# EAGLE design untitled (EAGLE 9.6.2)
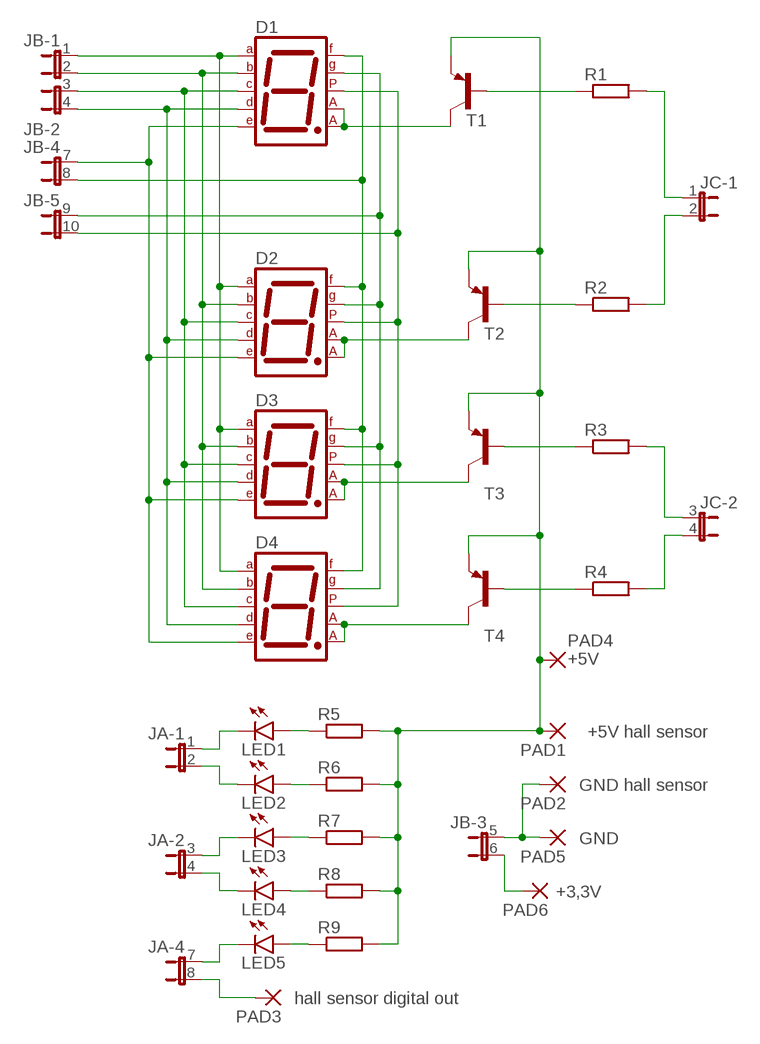
[diagram p0: schematic, sheet 1]

## Parts
D1  7SEG-CA  [7SEG-13]
D2  7SEG-CA  [7SEG-13]
D3  7SEG-CA  [7SEG-13]
D4  7SEG-CA  [7SEG-13]
JA  JP6QE  [JP6Q]
JB  JP6QE  [JP6Q]
JC  JP6QE  [JP6Q]
LED1  LED5MM  [LED5MM]
LED2  LED5MM  [LED5MM]
LED3  LED5MM  [LED5MM]
LED4  LED5MM  [LED5MM]
LED5  LED5MM  [LED5MM]
PAD1  +5V hall sensor  WIREPAD2,15/1,0  [2,15/1,0]
PAD2  GND hall sensor  WIREPAD2,15/1,0  [2,15/1,0]
PAD3  hall sensor digital out  WIREPAD2,15/1,0  [2,15/1,0]
PAD4  +5V  WIREPAD2,15/1,0  [2,15/1,0]
PAD5  GND  WIREPAD2,15/1,0  [2,15/1,0]
PAD6  +3,3V  WIREPAD2,15/1,0  [2,15/1,0]
R1  R-EU_0204/7  [0204/7]
R2  R-EU_0204/7  [0204/7]
R3  R-EU_0204/7  [0204/7]
R4  R-EU_0204/7  [0204/7]
R5  R-EU_0204/7  [0204/7]
R6  R-EU_0204/7  [0204/7]
R7  R-EU_0204/7  [0204/7]
R8  R-EU_0204/7  [0204/7]
R9  R-EU_0204/7  [0204/7]
T1  BC327-25-PNP-TO92-EBC  [TO92-EBC]
T2  BC327-25-PNP-TO92-EBC  [TO92-EBC]
T3  BC327-25-PNP-TO92-EBC  [TO92-EBC]
T4  BC327-25-PNP-TO92-EBC  [TO92-EBC]

## Nets
N$1: D1.7(A) D2.7(A) D3.7(A) D4.7(A) JB.1
N$2: D1.6(B) D2.6(B) D3.6(B) D4.6(B) JB.2
N$3: D1.2(D) D2.2(D) D3.2(D) D4.2(D) JB.4
N$4: D1.4(C) D2.4(C) D3.4(C) D4.4(C) JB.3
N$5: D1.1(E) D2.1(E) D3.1(E) D4.1(E) JB.7
N$6: D1.9(F) D2.9(F) D3.9(F) D4.9(F) JB.8
N$7: D1.10(G) D2.10(G) D3.10(G) D4.10(G) JB.9
N$8: D1.5(DP) D2.5(DP) D3.5(DP) D4.5(DP) JB.10
N$9: D1.3(CA1) D1.8(CA2) T1.C
N$10: D2.3(CA1) D2.8(CA2) T2.C
N$11: D3.3(CA1) D3.8(CA2) T3.C
N$12: D4.3(CA1) D4.8(CA2) T4.C
N$13: PAD1.1(P) PAD4.1(P) R5.2 R6.2 R7.2 R8.2 R9.2 T1.E T2.E T3.E T4.E
N$14: R1.1 T1.B
N$15: R2.1 T2.B
N$16: R3.1 T3.B
N$17: R4.1 T4.B
N$18: LED1.A R5.1
N$19: LED2.A R6.1
N$20: LED3.A R7.1
N$21: LED4.A R8.1
N$22: LED5.A R9.1
N$23: JC.1 R1.2
N$24: JC.2 R2.2
N$25: JC.3 R3.2
N$26: JC.4 R4.2
N$27: JA.1 LED1.K(C)
N$28: JA.2 LED2.K(C)
N$29: JA.3 LED3.K(C)
N$30: JA.4 LED4.K(C)
N$31: JA.7 LED5.K(C)
N$32: JA.8 PAD3.1(P)
N$33: JB.5 PAD2.1(P) PAD5.1(P)
N$34: JB.6 PAD6.1(P)
Unconnected: JA.5 JA.6 JA.9 JA.10 JA.11 JA.12 JB.11 JB.12 JC.5 JC.6 JC.7 JC.8 JC.9 JC.10 JC.11 JC.12

## Library data of the parts
D1-D4 = special:7SEG-CA: 7-segment DISPLAY single anode, 13 mm
JA JB JC = jumper:JP6QE: JUMPER
LED1-LED5 = led:LED: LED OSRAM: - CHIPLED LG R971, LG N971, LY N971, LG Q971, LY Q971, LO R971, LY R971 LH N974, LH R974 LS Q976, LO Q976, LY Q976 LO Q996 - Hyper CHIPLED LW Q18S LB Q993, LB Q99A, LB R99A - SideLED LS A670, LO A670, LY A670, LG A670, LP A670 LB A673, LV A673, LT A673, LW A673 LH A674 LY A675 LS A676, LA A676, LO A676, LY A676, LW A676 LS A679, LY A679, LG A679 - Hyper Micro SIDELED® LS Y876, LA Y876, LO Y876, LY Y876 LT Y87S - SmartLED LW L88C, LW L88S LB L89C, LB L89S, LG L890 LS L89K, LO L89K, LY L89K LS L896, LA L896, LO L896, LY L896 - TOPLED LS T670, LO T670, LY T670, LG T670, LP T670 LSG T670, LSP T670, LSY T670, LOP T670, LYG T670 LG T671, LOG T671, LSG T671 LB T673, LV T673, LT T673, LW T673 LH T674 LS T676, LA T676, LO T676, LY T676, LB T676, LH T676, LSB T676, LW T676 LB T67C, LV T67C, LT T67C, LS T67K, LO T67K, LY T67K, LW E67C LS E67B, LA E67B, LO E67B, LY E67B, LB E67C, LV E67C, LT E67C LW T67C LS T679, LY T679, LG T679 LS T770, LO T770, LY T770, LG T770, LP T770 LB T773, LV T773, LT T773, LW T773 LH T774 LS E675, LA E675, LY E675, LS T675 LS T776, LA T776, LO T776, LY T776, LB T776 LHGB T686 LT T68C, LB T68C - Hyper Mini TOPLED® LB M676 - Mini TOPLED Santana® LG M470 LS M47K, LO M47K, LY M47K Source: http://www.osram.convergy.de LUXEON: - LUMILED® LXK2-PW12-R00, LXK2-PW12-S00, LXK2-PW14-U00, LXK2-PW14-V00 LXK2-PM12-R00, LXK2-PM12-S00, LXK2-PM14-U00 LXK2-PE12-Q00, LXK2-PE12-R00, LXK2-PE12-S00, LXK2-PE14-T00, LXK2-PE14-U00 LXK2-PB12-K00, LXK2-PB12-L00, LXK2-PB12-M00, LXK2-PB14-N00, LXK2-PB14-P00, LXK2-PB14-Q00 LXK2-PR12-L00, LXK2-PR12-M00, LXK2-PR14-Q00, LXK2-PR14-R00 LXK2-PD12-Q00, LXK2-PD12-R00, LXK2-PD12-S00 LXK2-PH12-R00, LXK2-PH12-S00 LXK2-PL12-P00, LXK2-PL12-Q00, LXK2-PL12-R00 Source: www.luxeon.com KINGBRIGHT: KA-3528ASYC Source: www.kingbright.com
PAD1-PAD6 = wirepad:WIREPAD: Wire PAD connect wire on PCB
R1-R9 = rcl:R-EU_: RESISTOR, European symbol; SPICEPREFIX: R
T1-T4 = transistor:*-PNP-: PNP Transistror

## Board
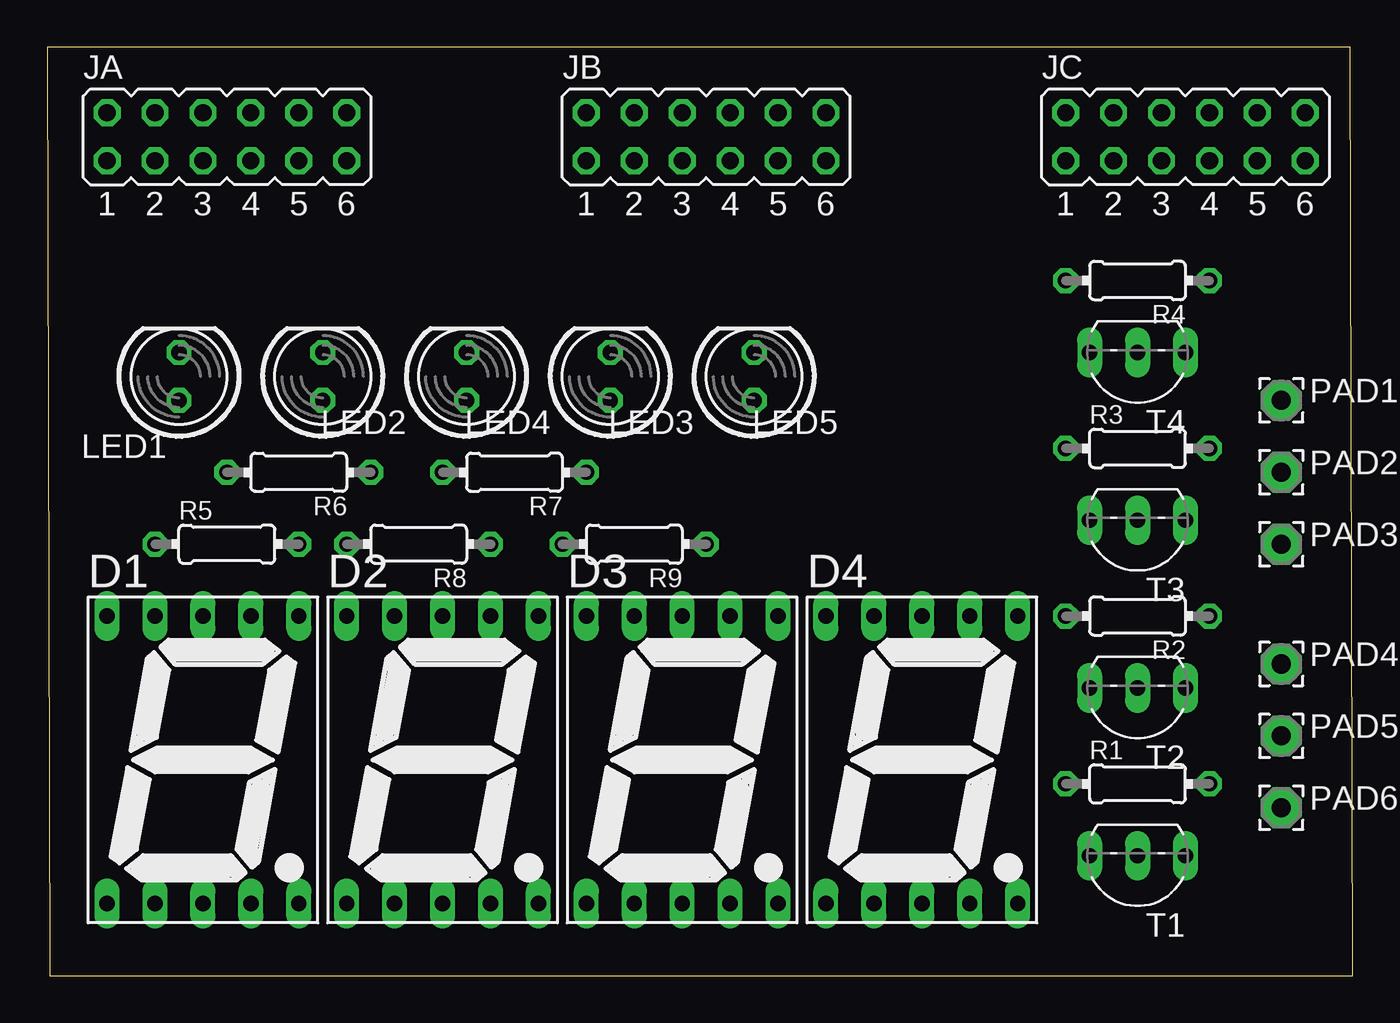
[diagram p1: board, top side]
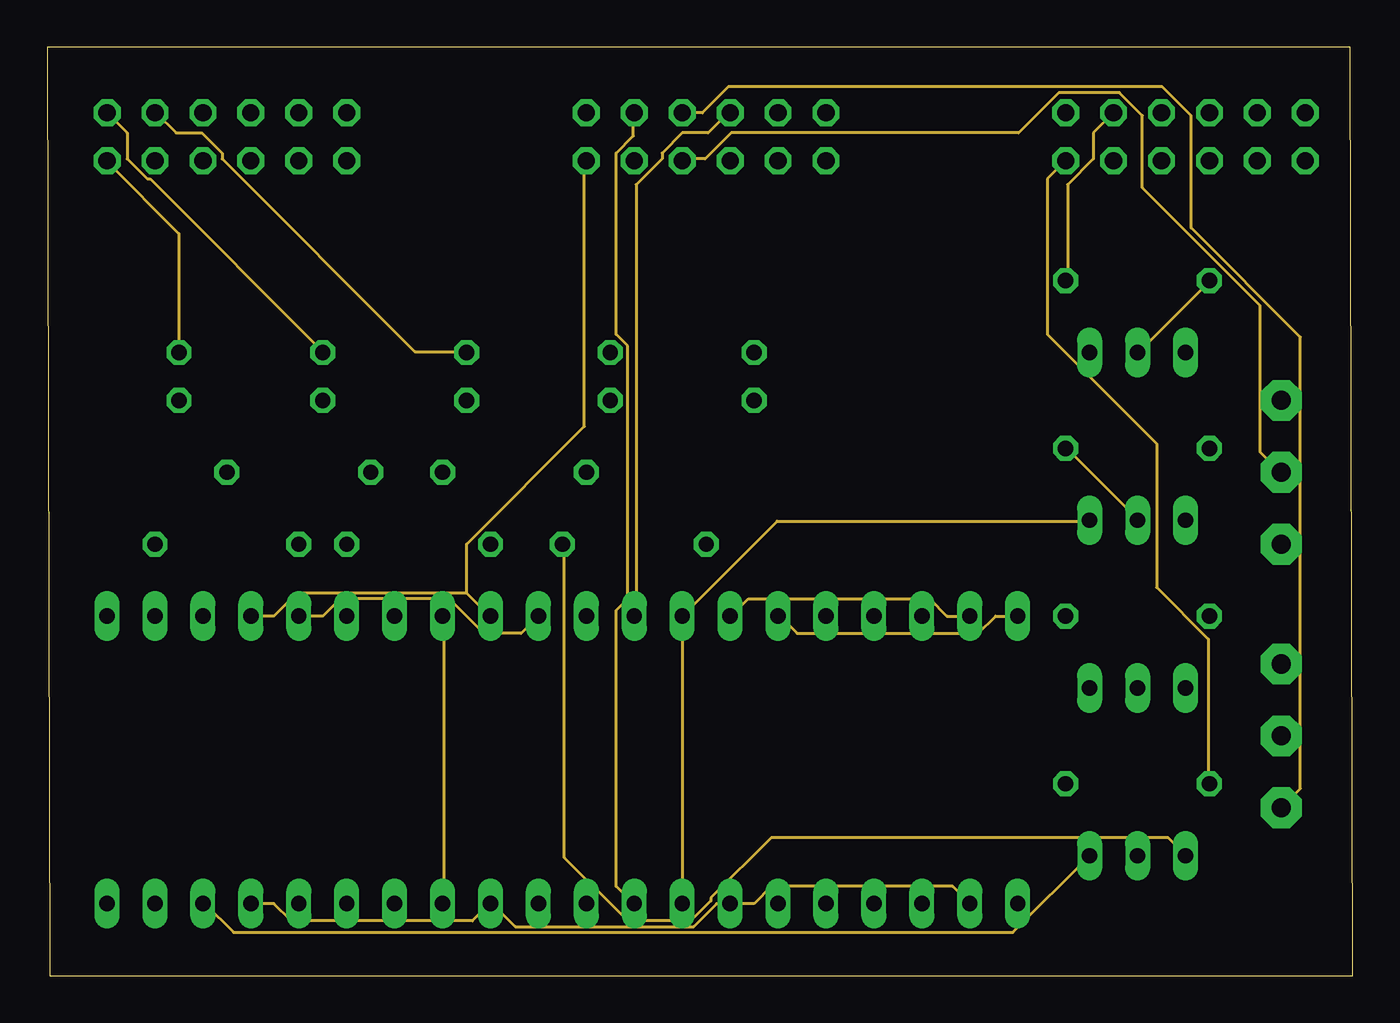
[diagram p2: board, inner layer Route15]
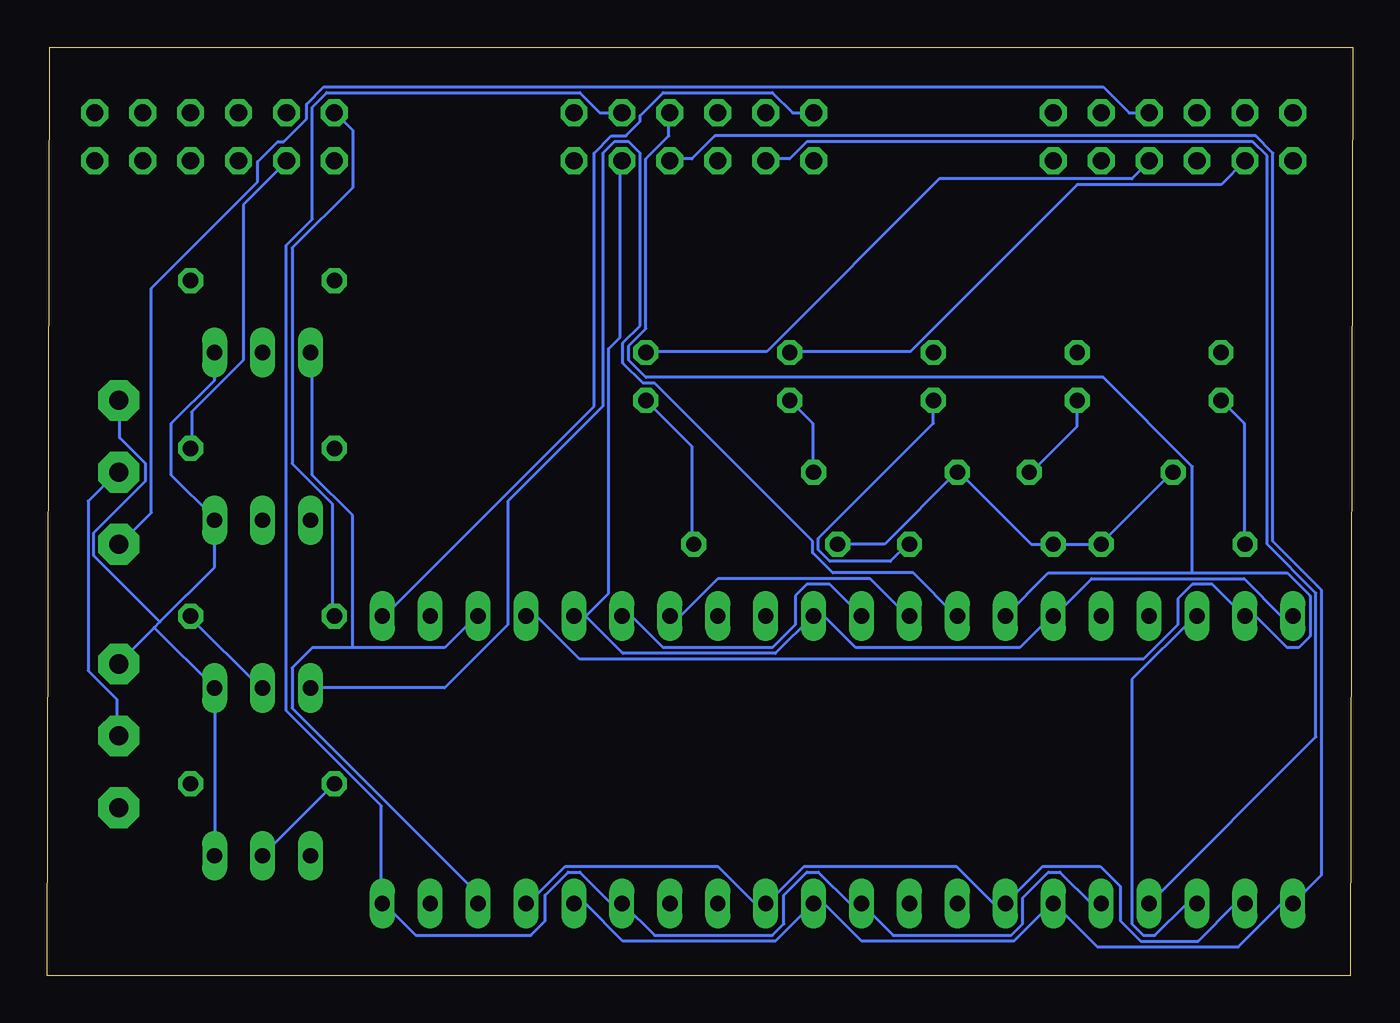
[diagram p3: board, bottom side, seen from below]

Size 69.2 x 49.2 mm. Coordinates in mm from the lower left corner, seen from the top.
Outline: 0.13,0 69.2,0 69.07,49.2 0,49.2 0.13,0
Copper layers (1+2*15+16): Top 0.035mm / dielectric 1.5mm / Route2 0.035mm / dielectric 0.15mm / Route15 0.035mm / dielectric 0.2mm / Bottom 0.035mm
Design rules "default *": minimum track width 6mil, minimum drill 0.35mm, track to track 6mil, track to pad 6mil, pad to pad 6mil, via to via 6mil, smd to smd 6mil, copper to edge 40mil, drill to drill 6mil, minimum pad ring 10mil, minimum via ring 8mil, stop-mask expansion 4mil, vias tented up to drill 0mil, thermal gap 10mil

### Footprints (pad centres in the part's own frame; a part is rotated, then mirrored left to right if it is on the bottom)
7SEG-13 = drill 0.813 long: 1 -5.08,-7.62; 2 -2.54,-7.62; 3 0,-7.62; 4 2.54,-7.62; 5 5.08,-7.62; 6 5.08,7.62; 7 2.54,7.62; 8 0,7.62; 9 -2.54,7.62; 10 -5.08,7.62
JP6Q = drill 0.914 octagon: 1 -6.35,-1.27; 2 -6.35,1.27; 3 -3.81,-1.27; 4 -3.81,1.27; 5 -1.27,-1.27; 6 -1.27,1.27; 7 1.27,-1.27; 8 1.27,1.27; 9 3.81,-1.27; 10 3.81,1.27; 11 6.35,-1.27; 12 6.35,1.27
LED5MM = drill 0.813 octagon: A -1.27,0; K 1.27,0
2,15/1,0 = drill 1.016 pad 2.159 octagon: 1 0,0
0204/7 = drill 0.813 octagon: 1 -3.81,0; 2 3.81,0
TO92-EBC = drill 0.813 long: B 0,-1.27; C 2.54,-1.27; E -2.54,-1.27

### Placement (x,y rotation side)
D1  8.26,11.43 0 top
D2  20.96,11.43 0 top
D3  33.66,11.43 0 top
D4  46.36,11.43 0 top
JA  9.53,44.45 0 top
JB  34.93,44.45 0 top
JC  60.33,44.45 0 top
LED1  6.99,31.75 90 top
LED2  14.61,31.75 90 top
LED3  29.84,31.75 90 top
LED4  22.23,31.75 90 top
LED5  37.47,31.75 90 top
PAD1  65.41,30.48 90 top
PAD2  65.41,26.67 90 top
PAD3  65.41,22.86 90 top
PAD4  65.41,16.51 90 top
PAD5  65.41,12.7 90 top
PAD6  65.41,8.89 90 top
R1  57.78,10.16 0 top
R2  57.78,19.05 180 top
R3  57.78,27.94 0 top
R4  57.78,36.83 180 top
R5  9.53,22.86 0 top
R6  13.33,26.67 180 top
R7  24.77,26.67 180 top
R8  19.69,22.86 180 top
R9  31.12,22.86 180 top
T1  57.78,5.08 180 top
T2  57.78,13.97 180 top
T3  57.78,22.86 180 top
T4  57.78,31.75 180 top

### Tracks (layer width: path | path; a pad name or v marks a point on that pad's centre or on a via)
N$1
  Route15 0.152: D1.7 12.01,19.05 13.23,20.27 22.23,20.27 | 22.23,20.27 23.44,19.05 D2.7 | D4.7 47.68,19.05 46.76,19.96 37.16,19.96 36.25,19.05 D3.7 | 22.23,20.27 22.23,22.86 28.47,29.11 28.47,43.13 JB.1
  Bottom 0.152: D3.7 35.64,19.05 33.66,21.03 25.58,21.03 23.6,19.05 D2.7
N$2
  Route15 0.152: D1.6 14.61,19.05 15.52,19.96 21.31,19.96 23.14,18.14 25.12,18.14 D2.6 | D4.6 50.27,19.05 49.35,18.14 39.75,18.14 38.84,19.05 D3.6
  Bottom 0.152: D3.6 38.23,19.05 36.55,17.37 30.76,17.37 29.54,18.59 29.54,20.12 28.93,20.73 27.71,20.73 D2.6 | JB.2 29.69,45.72 30.76,46.79 36.55,46.79 37.77,45.57 37.77,45.26 38.53,44.5 39.29,44.5 40.21,43.59 40.21,30.17 51.33,19.05 D4.6
N$3
  Route15 0.152: JB.4 31.06,45.72 31.06,44.5 30.15,43.59 30.15,33.98 30.76,33.38 30.76,19.96 30.15,19.35 30.15,4.72 31.06,3.81 D3.2
  Bottom 0.152: D1.2 6.22,3.81 8.2,1.83 11.25,1.83 12.32,2.9 12.32,4.72 13.39,5.79 16.43,5.79 D2.2 19.02,3.81 21.01,5.79 29.08,5.79 31.06,3.81 D3.2 31.67,3.81 33.66,5.79 41.73,5.79 43.71,3.81 D4.2
N$4
  Route15 0.152: D4.4 47.98,4.72 38.38,4.72 37.47,3.81 D3.4 35.48,3.81 34.27,2.59 24.82,2.59 23.6,3.81 D2.4 23.44,3.81 22.53,2.9 12.93,2.9 12.01,3.81 D1.4
  Bottom 0.152: D1.4 1.96,12.65 1.96,20.27 4.55,22.86 4.55,43.43 5.31,44.2 28.93,44.2 29.84,43.28 31.06,43.28 JB.3
N$5
  Bottom 0.152: D4.1 40.66,3.81 38.68,1.83 30.61,1.83 28.63,3.81 D3.1 28.02,3.81 26.04,1.83 17.96,1.83 15.98,3.81 D2.1 15.82,3.81 13.54,1.52 6.07,1.52 3.79,3.81 D1.1 1.65,5.33 1.65,20.42 4.24,23.01 4.24,43.59 5.16,44.5 33.81,44.5 35.03,43.28 36.09,43.28 JB.7
N$6
  Route15 0.152: D3.9 31.22,19.05 31.22,41.91 32.59,43.28 32.59,43.59 33.66,44.65 35.03,44.65 36.09,45.72 JB.8
  Bottom 0.152: 8.51,21.34 16.13,21.34 D2.9 | 8.51,21.34 3.48,21.34 2.26,20.12 2.26,17.98 2.87,17.37 3.48,17.37 5.16,19.05 D1.9 5.77,19.05 7.44,20.73 8.51,20.73 9.27,19.96 9.27,18.59 11.1,16.76 40.97,16.76 43.26,19.05 D4.9 | 8.51,21.34 8.51,26.98 13.23,31.7 37.47,31.7 38.38,32.61 38.38,33.38 37.47,34.29 37.47,43.28 36.25,44.5 36.25,45.72 JB.8
N$7
  Bottom 0.152: D1.10 3.79,19.05 5.77,21.03 13.84,21.03 15.82,19.05 D2.10 15.98,19.05 17.65,17.37 26.34,17.37 28.02,19.05 D3.10 28.63,19.05 30.61,17.07 38.68,17.07 40.66,19.05 | 40.66,19.05 39.45,20.27 39.45,33.22 38.84,33.83 38.84,43.13 JB.9 | 40.66,19.05 D4.10
N$8
  Bottom 0.152: D1.5 13.84,3.81 15.52,5.49 16.13,5.49 17.5,4.12 17.5,2.74 18.11,2.13 24.36,2.13 D2.5 26.65,3.81 28.32,5.49 28.93,5.49 30.15,4.27 30.15,2.74 30.76,2.13 37.01,2.13 38.68,3.81 D3.5 39.29,3.81 40.97,5.49 41.58,5.49 42.8,4.27 42.8,2.9 43.56,2.13 49.66,2.13 51.33,3.81 D4.5 51.49,3.81 51.49,8.99 56.52,14.02 56.52,38.71 55.14,40.08 55.14,46.02 54.38,46.79 40.97,46.79 39.9,45.72 JB.10
N$9
  Route15 0.152: T1.C 51.18,2.29 9.88,2.29 8.36,3.81 D1.3
  Bottom 0.152: D1.3 8.81,3.81 10.49,2.13 11.1,2.13 11.71,2.74 11.71,15.7 8.36,19.05 D1.8
N$10
  Route15 0.152: D2.3 21.01,3.81 21.01,19.05 D2.8
  Bottom 0.152: T2.C 48.13,15.24 44.78,18.59 44.78,25.15 39.75,30.17 39.75,43.59 39.14,44.2 38.38,44.2 37.77,43.59 37.77,34.44 38.68,33.53 38.68,32.46 37.62,31.39 37.01,31.39 28.63,23.01 28.63,22.4 27.56,21.34 23.29,21.34 21.01,19.05 D2.8
N$11
  Route15 0.152: D3.3 D3.8 38.68,24.08 55.14,24.08 T3.C
N$12
  Bottom 0.152: 53.01,17.37 48.13,17.37 46.46,19.05 D4.8 | 53.01,17.37 55.14,17.37 56.21,16.31 56.21,14.17 46.46,4.42 46.46,3.81 D4.3 | 53.01,17.37 53.01,24.38 55.14,26.52 55.14,32.92 T4.C
N$13
  Route15 0.152: R9.2 27.41,22.86 27.41,6.25 30.76,2.9 34.11,2.9 35.18,3.96 35.18,4.12 38.38,7.31 59.41,7.31 60.33,6.4 T1.E
  Bottom 0.152: 13.39,22.86 R8.2 17.04,22.86 20.85,26.67 R7.2 21.01,26.67 24.82,22.86 R9.2 | 13.39,22.86 9.58,26.67 R6.2 | 13.39,22.86 R5.2 | T1.E T2.E 63.53,18.44 | 63.53,18.44 65.35,16.61 PAD4.1 | 63.53,18.44 63.22,18.74 | 63.22,18.74 60.33,21.64 T3.E 60.33,24.23 62.61,26.52 62.61,29.26 60.33,31.55 T4.E | 63.22,18.74 66.73,22.25 66.73,23.47 63.98,26.21 63.98,27.13 65.35,28.5 65.35,30.48 PAD1.1
N$14
  Bottom 0.152: T1.B R1.1
N$15
  Bottom 0.152: T2.B 57.89,15.24 61.7,19.05 R2.1
N$16
  Route15 0.152: R3.1 54.08,27.89 57.73,24.23 T3.B
N$17
  Route15 0.152: T4.B 57.89,33.07 61.54,36.73 R4.1
N$18
  Bottom 0.152: LED1.A 5.77,29.26 5.77,22.86 R5.1
N$19
  Bottom 0.152: LED2.A 14.61,29.11 17.04,26.67 R6.1
N$20
  Bottom 0.152: LED3.A 28.63,29.26 28.63,26.67 R7.1
N$21
  Bottom 0.152: LED4.A 22.23,29.26 28.32,23.16 28.32,22.55 27.71,21.95 24.51,21.95 23.6,22.86 R8.1
N$22
  Bottom 0.152: LED5.A 35.03,28.04 35.03,22.86 R9.1
N$23
  Route15 0.152: JC.1 53.01,42.21 53.01,33.98 58.8,28.19 58.8,20.57 61.54,17.83 61.54,10.21 R1.2
N$24
  Bottom 0.152: R2.2 54.08,19.05 54.08,24.99 56.21,27.13 56.21,38.56 53.01,41.76 53.01,44.81 53.92,45.72 JC.2
N$25
  Bottom 0.152: R3.2 61.54,28.04 61.54,29.87 58.8,32.61 58.8,40.84 56.52,43.13 JC.3
N$26
  Route15 0.152: JC.4 55.45,44.65 55.45,43.28 54.08,41.91 54.08,36.88 R4.2
N$27
  Route15 0.152: LED1.K 6.99,39.32 3.18,43.13 JA.1
N$28
  Route15 0.152: JA.2 4.24,44.65 4.24,43.28 5.31,42.21 5.46,42.21 14.61,33.07 LED2.K
N$29
  Bottom 0.152: JA.3 6.99,41.91 14.61,41.91 23.44,33.07 29.84,33.07 LED3.K
N$30
  Route15 0.152: LED4.K 22.23,33.07 19.48,33.07 9.27,43.28 9.27,43.59 8.2,44.65 6.83,44.65 5.77,45.72 JA.4
N$31
  Bottom 0.152: LED5.K 37.47,33.07 31.06,33.07 21.92,42.21 11.71,42.21 10.79,43.13 JA.7
N$32
  Bottom 0.152: JA.8 11.86,45.72 13.23,47.09 54.53,47.09 55.45,46.18 55.45,45.41 56.67,44.2 56.97,44.2 58.04,43.13 58.04,42.06 63.68,36.42 63.68,24.54 65.35,22.86 PAD3.1
N$33
  Route15 0.152: JB.5 33.66,43.28 34.87,43.28 36.25,44.65 51.49,44.65 53.62,46.79 56.82,46.79 58.04,45.57 58.04,41.76 64.29,35.51 64.29,27.74 65.35,26.67 PAD2.1
  Bottom 0.152: PAD5.1 65.51,12.8 65.51,14.63 67.03,16.15 67.03,25.15 65.51,26.67 PAD2.1
N$34
  Route15 0.152: JB.6 34.72,45.72 36.09,47.09 59.11,47.09 60.63,45.57 60.63,39.62 66.42,33.83 66.42,9.91 PAD6.1

### Text on the board
Document: distance [km] | time | max speed | speed [km/h] | kcal | +5V hall sensor | GND hall sensor | hall sensor digital | IN +5V | GND | OUT +3,3V